# EAGLE design attiny85breakout (EAGLE 7.2.0)
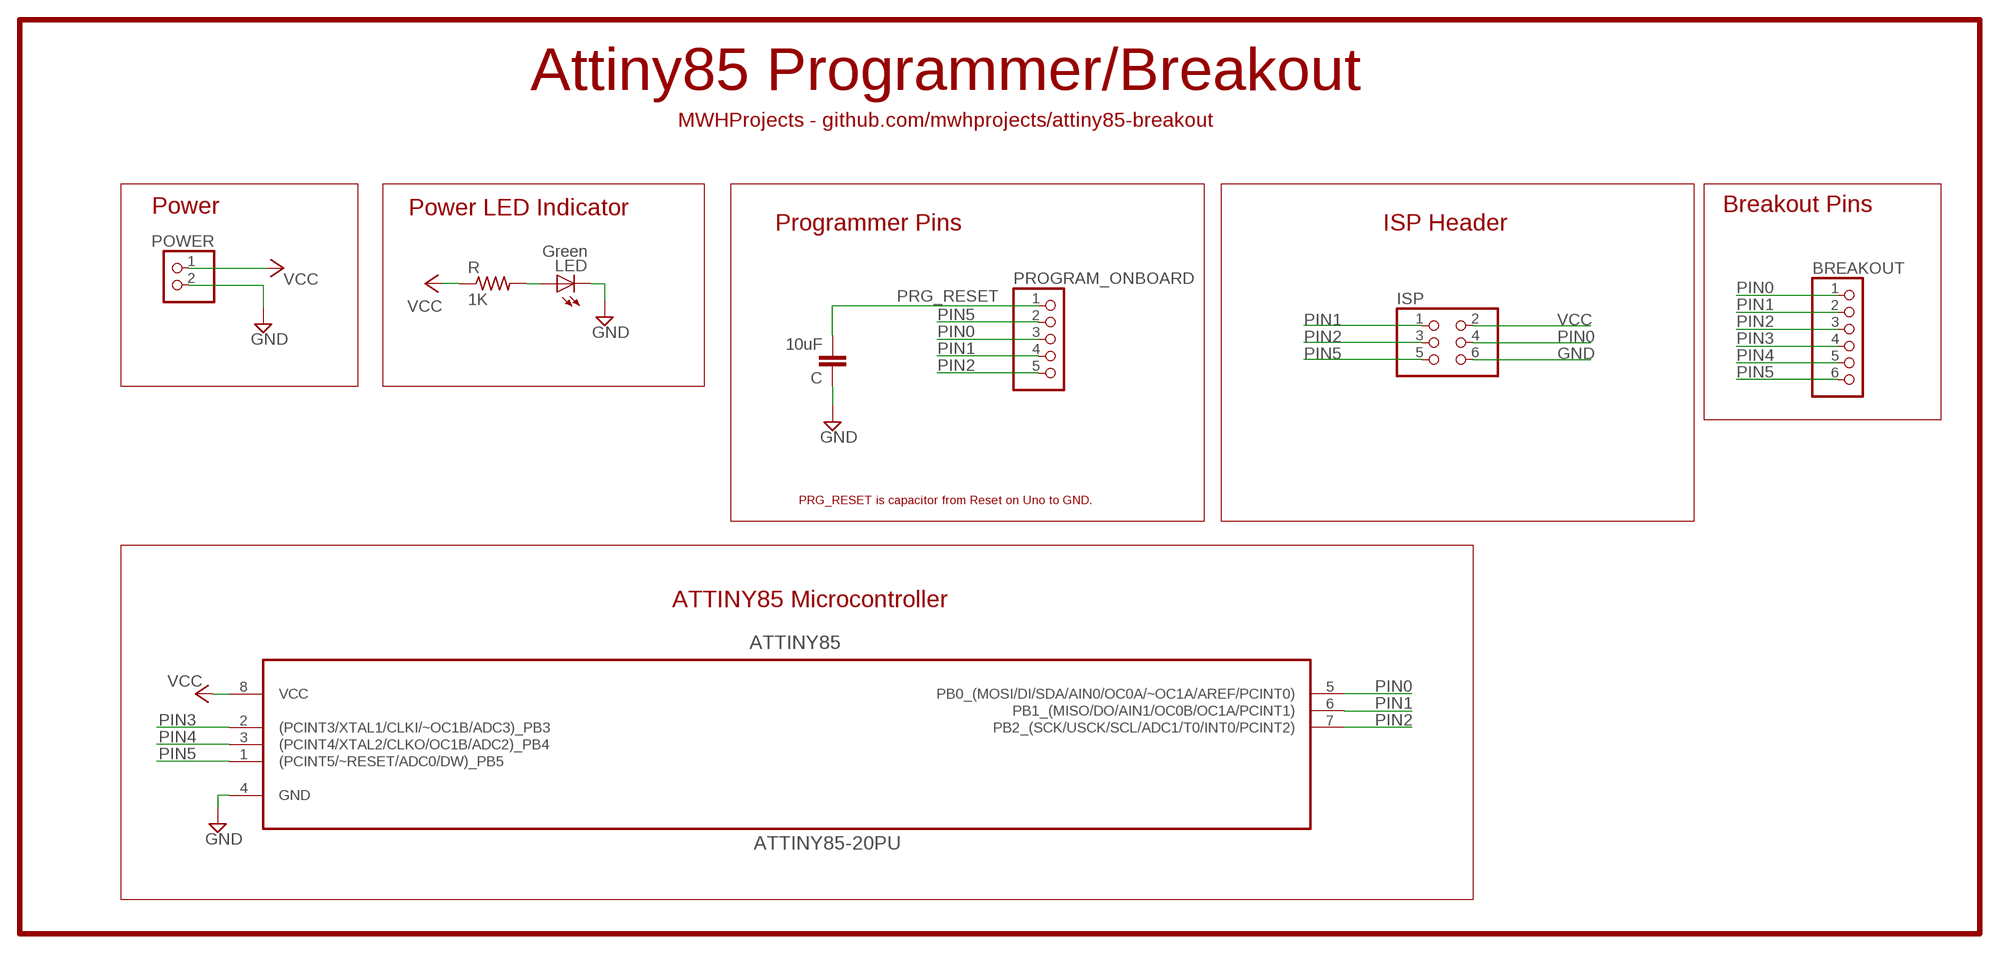
[diagram p0: schematic, sheet 1]

## Parts
ATTINY85  ATTINY85-20PU  [DIP254P762X533-8]
BREAKOUT  0  PINHD-1X6  [1X06]
C  10uF  C-EUC0805  [C0805]
ISP  PINHD-2X3  [2X03]
LED  Green  LEDCHIP-LED0805  [CHIP-LED0805]
POWER  0  PINHD-1X2  [1X02]
PROGRAM_ONBOARD  0  PINHD-1X5  [1X05]
R  1K  R-US_R0805  [R0805]

## Nets
GND: ATTINY85.4(GND) C.1 ISP.6 LED.C POWER.2
N$2: LED.A R.2
PIN0: ATTINY85.5(PB0_(MOSI/DI/SDA/AIN0/OC0A/~OC1A/AREF/PCINT0)) BREAKOUT.1 ISP.4 PROGRAM_ONBOARD.3
PIN1: ATTINY85.6(PB1_(MISO/DO/AIN1/OC0B/OC1A/PCINT1)) BREAKOUT.2 ISP.1 PROGRAM_ONBOARD.4
PIN2: ATTINY85.7(PB2_(SCK/USCK/SCL/ADC1/T0/INT0/PCINT2)) BREAKOUT.3 ISP.3 PROGRAM_ONBOARD.5
PIN3: ATTINY85.2((PCINT3/XTAL1/CLKI/~OC1B/ADC3)_PB3) BREAKOUT.4
PIN4: ATTINY85.3((PCINT4/XTAL2/CLKO/OC1B/ADC2)_PB4) BREAKOUT.5
PIN5: ATTINY85.1((PCINT5/~RESET/ADC0/DW)_PB5) BREAKOUT.6 ISP.5 PROGRAM_ONBOARD.2
PRG_RESET: C.2 PROGRAM_ONBOARD.1
VCC: ATTINY85.8(VCC) ISP.2 POWER.1 R.1

## Notes on the sheet
- Attiny85 Programmer/Breakout
- MWHProjects - github.com/mwhprojects/attiny85-breakout
- Power | Power LED Indicator | Breakout Pins
- Programmer Pins | ISP Header
- PRG_RESET is capacitor from Reset on Uno to GND.
- ATTINY85 Microcontroller

## Library data of the parts
ATTINY85 = Atmel_By_element14_Batch_1-00:ATTINY85-20PU: 8-bit Microcontroller with In-System Programmable Flash; MPN: ATTINY85-20PU; OC_FARNELL: 1455162; OC_NEWARK: 58M3796; PACKAGE: PDIP-8; SUPPLIER: Atmel
BREAKOUT = pinhead:PINHD-1X6: PIN HEADER
C = resistor:C-EU: CAPACITOR, European symbol
ISP = pinhead:PINHD-2X3: PIN HEADER
LED = led:LED: LED OSRAM: - CHIPLED LG R971, LG N971, LY N971, LG Q971, LY Q971, LO R971, LY R971 LH N974, LH R974 LS Q976, LO Q976, LY Q976 LO Q996 - Hyper CHIPLED LW Q18S LB Q993, LB Q99A, LB R99A - SideLED LS A670, LO A670, LY A670, LG A670, LP A670 LB A673, LV A673, LT A673, LW A673 LH A674 LY A675 LS A676, LA A676, LO A676, LY A676, LW A676 LS A679, LY A679, LG A679 - Hyper Micro SIDELED® LS Y876, LA Y876, LO Y876, LY Y876 LT Y87S - SmartLED LW L88C, LW L88S LB L89C, LB L89S, LG L890 LS L89K, LO L89K, LY L89K LS L896, LA L896, LO L896, LY L896 - TOPLED LS T670, LO T670, LY T670, LG T670, LP T670 LSG T670, LSP T670, LSY T670, LOP T670, LYG T670 LG T671, LOG T671, LSG T671 LB T673, LV T673, LT T673, LW T673 LH T674 LS T676, LA T676, LO T676, LY T676, LB T676, LH T676, LSB T676, LW T676 LB T67C, LV T67C, LT T67C, LS T67K, LO T67K, LY T67K, LW E67C LS E67B, LA E67B, LO E67B, LY E67B, LB E67C, LV E67C, LT E67C LW T67C LS T679, LY T679, LG T679 LS T770, LO T770, LY T770, LG T770, LP T770 LB T773, LV T773, LT T773, LW T773 LH T774 LS E675, LA E675, LY E675, LS T675 LS T776, LA T776, LO T776, LY T776, LB T776 LHGB T686 LT T68C, LB T68C - Hyper Mini TOPLED® LB M676 - Mini TOPLED Santana® LG M470 LS M47K, LO M47K, LY M47K Source: http://www.osram.convergy.de LUXEON: - LUMILED® LXK2-PW12-R00, LXK2-PW12-S00, LXK2-PW14-U00, LXK2-PW14-V00 LXK2-PM12-R00, LXK2-PM12-S00, LXK2-PM14-U00 LXK2-PE12-Q00, LXK2-PE12-R00, LXK2-PE12-S00, LXK2-PE14-T00, LXK2-PE14-U00 LXK2-PB12-K00, LXK2-PB12-L00, LXK2-PB12-M00, LXK2-PB14-N00, LXK2-PB14-P00, LXK2-PB14-Q00 LXK2-PR12-L00, LXK2-PR12-M00, LXK2-PR14-Q00, LXK2-PR14-R00 LXK2-PD12-Q00, LXK2-PD12-R00, LXK2-PD12-S00 LXK2-PH12-R00, LXK2-PH12-S00 LXK2-PL12-P00, LXK2-PL12-Q00, LXK2-PL12-R00 Source: www.luxeon.com KINGBRIGHT: KA-3528ASYC Source: www.kingbright.com
POWER = pinhead:PINHD-1X2: PIN HEADER
PROGRAM_ONBOARD = pinhead:PINHD-1X5: PIN HEADER
R = resistor:R-US_: RESISTOR, American symbol

## Board
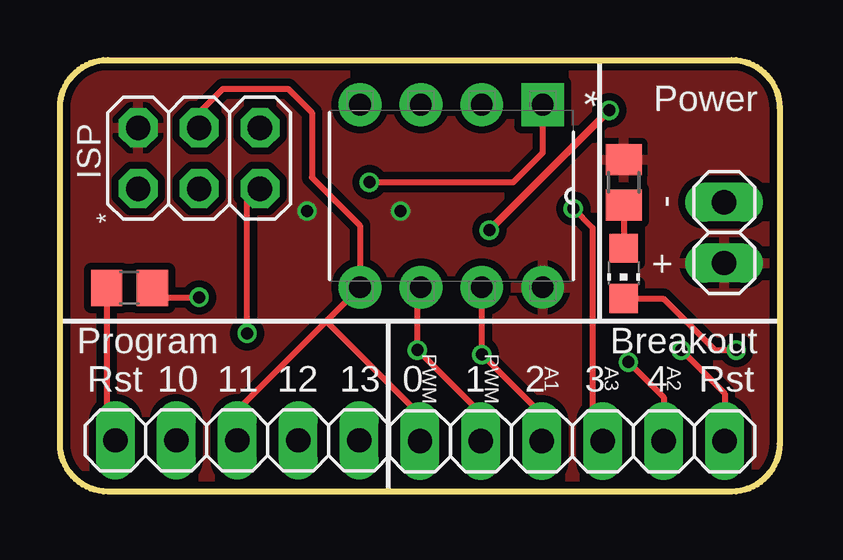
[diagram p1: board, top side]
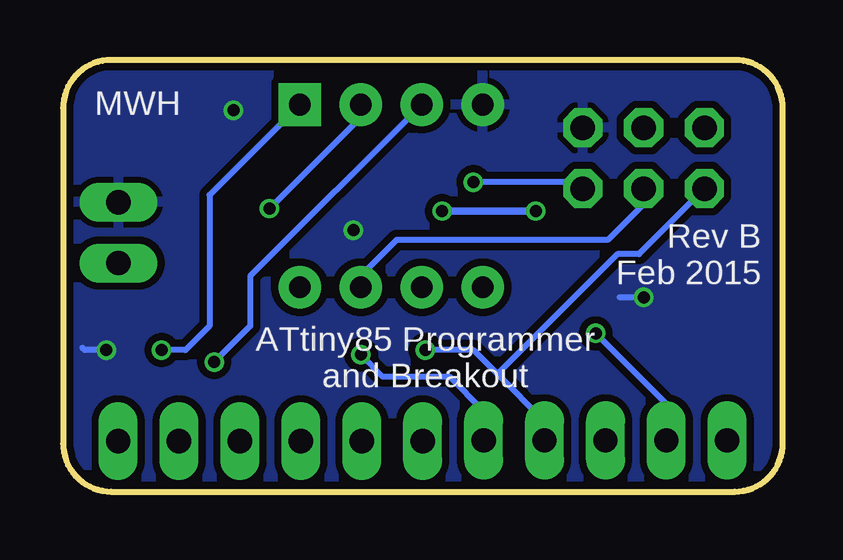
[diagram p2: board, bottom side, seen from below]

Size 30 x 18 mm. Coordinates in mm from the lower left corner, seen from the top.
Outline: 0,16 arc-90 2,18 28,18 arc-90 30,16 30,2 arc-90 28,0 2,0 arc-90 0,2 0,16
Copper layers (1*16): Top 0.035mm / dielectric 1.5mm / Bottom 0.035mm
Design rules "dirt_cheap_dirty_boards.v1 *": minimum track width 5mil, minimum drill 12mil, track to track 10mil, track to pad 10mil, pad to pad 10mil, via to via 10mil, smd to smd 0mil, copper to edge 10mil, drill to drill 10mil, minimum pad ring 12mil, minimum via ring 6mil, stop-mask expansion 2mil, vias tented up to drill 25mil, thermal gap 10mil

### Footprints (pad centres in the part's own frame; a part is rotated, then mirrored left to right if it is on the bottom)
DIP254P762X533-8 = drill 0.9 pad 1.778 square: 1 -7.62,7.62 | drill 0.9 pad 1.778: 2 -7.62,5.08; 3 -7.62,2.54; 4 -7.62,0; 5 0,0; 6 0,2.54; 7 0,5.08; 8 0,7.62
1X06 = drill 1.016 long: 1 -6.35,0; 2 -3.81,0; 3 -1.27,0; 4 1.27,0; 5 3.81,0; 6 6.35,0
C0805 = smd 1.3 x 1.5: 1 -0.95,0; 2 0.95,0
2X03 = drill 1.016 octagon: 1 -2.54,-1.27; 2 -2.54,1.27; 3 0,-1.27; 4 0,1.27; 5 2.54,-1.27; 6 2.54,1.27
CHIP-LED0805 = smd 1.2 x 1.2: A 0,-1.05; C 0,1.05
1X02 = drill 1.016 long: 1 -1.27,0; 2 1.27,0
1X05 = drill 1.016 long: 1 -5.08,0; 2 -2.54,0; 3 0,0; 4 2.54,0; 5 5.08,0
R0805 = smd 1.3 x 1.5: 1 -0.95,0; 2 0.95,0

### Placement (x,y rotation side)
ATTINY85  12.51,8.52 270 top
BREAKOUT  21.36,2.1 0 top
C  2.9,8.5 180 top
ISP  5.8,13.9 0 top
LED  23.5,9.1 180 top
POWER  27.7,10.8 90 top
PROGRAM_ONBOARD  7.39,2.14 0 top
R  23.5,12.9 270 top

### Tracks (layer width: path | path; a pad name or v marks a point on that pad's centre or on a via)
GND  (via drill 0.5)
  Top 0.254: C.1 4.05,8.1 v5.8,8.1 | LED.C 25.15,8.05 27.3,5.9 v28.2,5.9
  Top 0.305: v17.9,10.9 v22.9,15.9
  Bottom 0.254: v5.8,8.1 6.8,8.1 | v28.2,5.9 29.1,5.9 29.2,6
  pour Bottom (isolate 0.305): 0,18 0,0 30,0 30,18
N$2
  Top 0.254: R.2 LED.A
PIN0
  Top 0.254: 11.05,7.05 ATTINY85.5 12.51,11.09 10.5,13.1 10.5,15.8 9.5,16.8 6.8,16.8 5.8,15.8 ISP.4 | 11.05,7.05 11.15,7.05 15.01,3.19 BREAKOUT.1 | 11.05,7.05 7.39,3.39 PROGRAM_ONBOARD.3
PIN1  (via drill 0.5)
  Top 0.254: ATTINY85.6 14.9,8.37 v14.9,5.9 17.55,3.25 BREAKOUT.2
  Bottom 0.254: ISP.1 5.99,9.9 6.9,9.9 11.9,4.9 | 11.9,4.9 12.9,5.9 v14.9,5.9 | PROGRAM_ONBOARD.4 9.93,2.93 11.9,4.9
PIN2  (via drill 0.5)
  Top 0.254: ATTINY85.7 v17.59,5.71 20.09,3.21 BREAKOUT.3
  Bottom 0.254: ISP.3 5.8,12 7.3,10.5 16.1,10.5 17.59,9.01 ATTINY85.7 | v17.59,5.71 16.68,4.8 13.9,4.8 12.47,3.37 PROGRAM_ONBOARD.5
PIN3  (via drill 0.5)
  Top 0.254: BREAKOUT.4 22.2,2.53 22.2,11 v21.4,11.8
  Bottom 0.254: ATTINY85.2 17.59,15.61 v21.4,11.8
PIN4  (via drill 0.5)
  Top 0.254: v23.7,5.4 25.17,3.93 BREAKOUT.5
  Bottom 0.254: ATTINY85.3 22.2,8.99 22.2,6.9 v23.7,5.4
PIN5  (via drill 0.5)
  Top 0.254: v12.9,12.9 18.9,12.9 20.13,14.13 ATTINY85.1 | v7.8,6.6 7.8,12.09 ISP.5 | v25.9,5.9 27.71,4.09 BREAKOUT.6
  Bottom 0.254: ATTINY85.1 23.9,12.37 23.9,6.9 24.9,5.9 v25.9,5.9 | ISP.5 8.61,12.9 v12.9,12.9 | v7.8,6.6 4.9,3.7 4.9,2.18 PROGRAM_ONBOARD.2
PRG_RESET
  Top 0.254: C.2 1.95,2.5 PROGRAM_ONBOARD.1
VCC  (via drill 0.5)
  Bottom 0.305: v14.2,11.7 v10.3,11.7
  pour Top (isolate 0.305): 0,18 0,0 30,0 30,18

### Text on the board
tPlace: Power | ISP | - | * | + | Program | Breakout | Rst | 10 | 11 | 12 | 13 | 0 | PWM | 1 | PWM | 2 | A1 | 3 | A3 | 4 | A2 | Rst
bPlace: MWH | Rev B / Feb 2015 | ATtiny85 Programmer / and Breakout